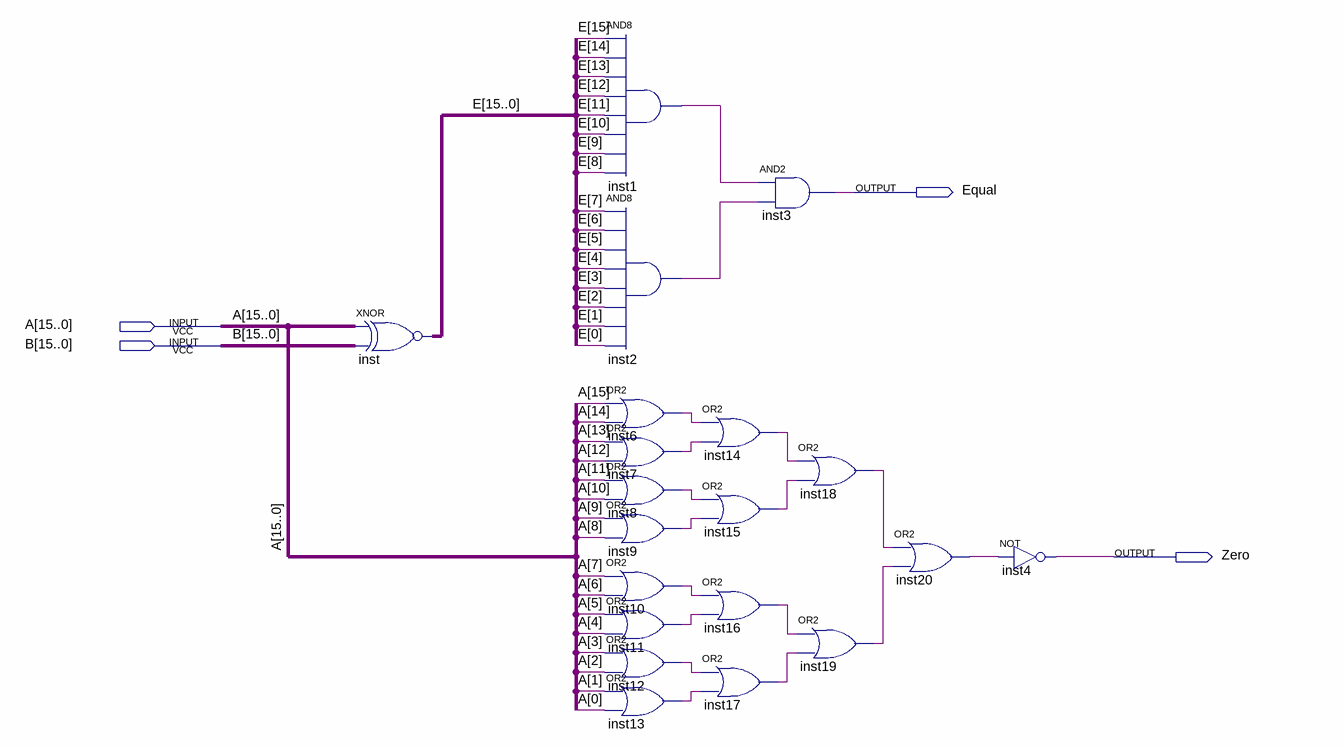
[diagram p0: schematic sheet]
// Quartus schematic Comparator_v2.bdf as structural Verilog: 20 symbols, 4 pins
module Comparator_v2 (
  input  [15:0] A,
  input  [15:0] B,
  output Equal,
  output Zero
);

  wire inst1_out, inst2_out, inst6_out, inst7_out, inst8_out, inst9_out, inst10_out, inst11_out, inst12_out,
       inst13_out, inst14_out, inst15_out, inst16_out, inst17_out, inst18_out, inst19_out, inst20_out;
  wire [15:0] E;

  assign E = ~(A ^ B);  // XNOR inst, 16 bits wide
  and inst1 (inst1_out, E[15], E[14], E[13], E[12], E[11], E[10], E[9], E[8]);
  and inst2 (inst2_out, E[7], E[6], E[5], E[4], E[3], E[2], E[1], E[0]);
  or inst6 (inst6_out, A[15], A[14]);
  or inst7 (inst7_out, A[13], A[12]);
  or inst8 (inst8_out, A[11], A[10]);
  or inst9 (inst9_out, A[9], A[8]);
  or inst10 (inst10_out, A[7], A[6]);
  or inst11 (inst11_out, A[5], A[4]);
  or inst12 (inst12_out, A[3], A[2]);
  or inst13 (inst13_out, A[1], A[0]);
  and inst3 (Equal, inst1_out, inst2_out);
  or inst14 (inst14_out, inst6_out, inst7_out);
  or inst15 (inst15_out, inst8_out, inst9_out);
  or inst16 (inst16_out, inst10_out, inst11_out);
  or inst17 (inst17_out, inst12_out, inst13_out);
  or inst18 (inst18_out, inst14_out, inst15_out);
  or inst19 (inst19_out, inst16_out, inst17_out);
  or inst20 (inst20_out, inst18_out, inst19_out);
  not inst4 (Zero, inst20_out);
endmodule
